# Altium schematic sheet Photodiode.SchDoc: Lab. Proj. PCB
size A4; Author: Tomasz Machnik; Revision: 1; SheetNumber: 5; SheetTotal: 7
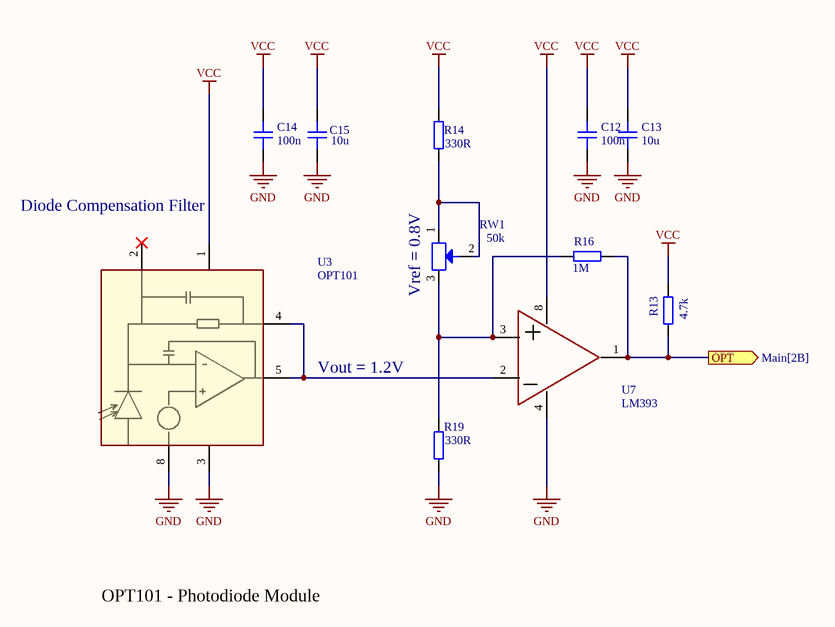
[diagram p0: Photodiode.SchDoc]

## Parts
C12  100n  [CAP_0805]
C13  10u  [CAP_0805]
C14  100n  [CAP_0805]
C15  10u  [CAP_0805]
R13  4.7k  [RES_0805]
R14  330R  [RES_0805]
R16  1M  [RES_0805]
R19  330R  [RES_0805]
RW1  50k  [Potentiometer]
U3  OPT101  [OPT101]
U7  LM393  [LM393]

## Ports
OPT (out, see Main[2B])

## Nets
GND: C12.1 C13.1 C14.1 C15.1 R19.1 U3.3 U3.8 U7.4(VSS)
VCC: C12.2 C13.2 C14.2 C15.2 R13.2 R14.2 U3.1 U7.8
OPT: R13.1 R16.1 U7.1(OUT) ; port OPT
NetR14_1: R14.1 RW1.1 RW1.2
NetR16_2: R16.2 R19.2 RW1.3 U7.3
NetU3_4: U3.4 U3.5 U7.2

Not connected (* = marked no-connect by the designer): U3 2(17)*

## Notes on the sheet
- Diode Compensation Filter
- (near RW1) Vref = 0.8V
- Vout = 1.2V
- OPT101 - Photodiode Module
- Title:
- Author:
- Approved:
- Size:
- Date:
- Git Hash:
- A4
- Prj:
- SW Version:
- Variant:
- Edited:
- CONFIDENTIAL
- File:

## Library data of the parts
C12-C15 = CAP_0805: Capacitor SMD 0805; Manufacturer: *; Manufacturer Part Number: *; Distributor Link: *; LCSC: *; Rating: *; Dielectric: *
R13 R14 R16 R19 = RES_0805: Resistor SMD 0805; Manufacturer: *; Manufacturer Part Number: *; Distributor Link: *; LCSC: *
RW1 = Potentiometer: Parameter 1: *
U3 = OPT101: Photodiode Module
U7 = LM393: LLM393 - Comparator